# Altium schematic sheet UART.SchDoc
size A4; SheetNumber: 8; SheetTotal: 8
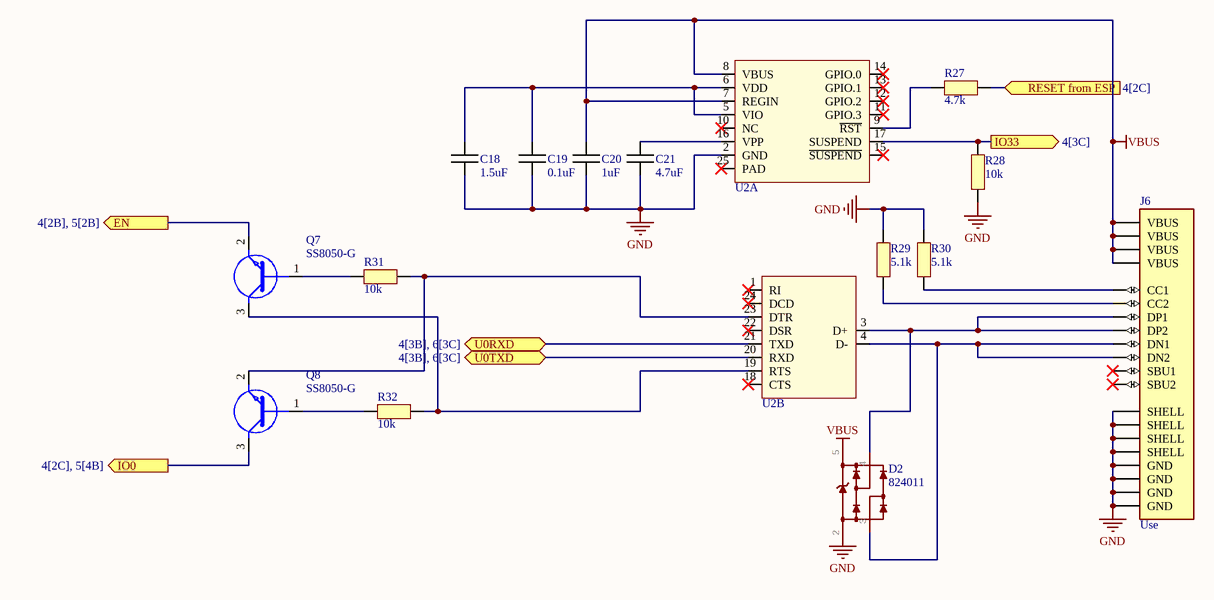
[diagram p0: UART.SchDoc]

## Parts
C18  1.5uF  [CAPC1005X06N]
C19  0.1uF  [CAPC1005X06N]
C20  1uF  [CAPC1005X06N]
C21  4.7uF  [CAPC1005X06N]
D2  824011  [824011]
J6  Use  [USB4085-GF-A]
Q7  SS8050-G  [SS8050-G]
Q8  SS8050-G  [SS8050-G]
R27  4.7k  [RESC1005X06N]
R28  10k  [RESC1005X06N]
R29  5.1k  [RESC1005X06N]
R30  5.1k  [RESC1005X06N]
R31  10k  [RESC1005X06N]
R32  10k  [RESC1005X06N]
U2  CP2104-F03-GM  [PQFN50P400X400X80_HS-25N]  (value not drawn)  (parts A,B of 2)

## Ports
EN (out, see 4[2B], 5[2B]), IO0 (out, see 4[2C], 5[4B]), IO33 (out, see 4[3C]), RESET from ESP (in, see 4[2C]), U0RXD (bidir, see 4[3B], 6[3C]), U0TXD (bidir, see 4[3B], 6[3C])

## Nets
GND: C18.2 C19.2 C20.2 C21.2 D2.2(GND) J6.A1(GND) J6.A12(GND) J6.B1(GND) J6.B12(GND) J6.S1(SHELL) J6.S2(SHELL) J6.S3(SHELL) J6.S4(SHELL) R28.2 R29.2 R30.2 U2.2(GND)
VBUS: C20.1 D2.5(VDD) J6.A4(VBUS) J6.A9(VBUS) J6.B4(VBUS) J6.B9(VBUS) U2.7(REGIN) U2.8(VBUS)
EN: Q7.2(E) ; port EN
IO0: Q8.3(C) ; port IO0
IO33: R28.1 U2.17(SUSPEND) ; port IO33
RESET from ESP: R27.1 ; port RESET from ESP
U0RXD: U2.21(TXD) ; port U0RXD
U0TXD: U2.20(RXD) ; port U0TXD
NetC18_1: C18.1 C19.1 U2.5(VIO) U2.6(VDD)
NetC21_1: C21.1 U2.16(VPP)
NetD2_3: D2.3 J6.A7(DN1) J6.B7(DN2) U2.4(D-)
NetD2_4: D2.4 J6.A6(DP1) J6.B6(DP2) U2.3(D+)
NetJ6_A5: J6.A5(CC1) R30.1
NetJ6_B5: J6.B5(CC2) R29.1
NetQ7_1: Q7.1(B) R31.2
NetQ7_3: Q7.3(C) R32.1 U2.19(RTS)
NetQ8_1: Q8.1(B) R32.2
NetQ8_2: Q8.2(E) R31.1 U2.23(DTR)
NetR27_2: R27.2 U2.9(~{RST})

Not connected (* = marked no-connect by the designer): J6 A8(SBU1)* B8(SBU2)*; U2 1(RI)* 10(NC)* 11(GPIO.3)* 12(GPIO.2)* 13(GPIO.1)* 14(GPIO.0)* 15(~{SUSPEND})* 18(CTS)* 22(DSR)* 24(DCD)* 25(PAD)*

## Library data of the parts
C18-C21 = Capacitor
D2 = 824011: TVS Diode Array WE-TVS, High Speed Series  - Low capazity - No leakage current - Low clamping voltage - high ESD voltage protection  -- USB 1.0 - 2.0
J6 = USB4085-GF-A: Connecteurs USB USB Type C, 2.0, Rec, TH , G/F, RA , Top Mnt, T & R
Q7 Q8 = SS8050-G: Bipolar Transistors - BJT NPN TRANSISTOR 1.5A 40V
R27-R32 = Resistor
U2 = USBBridge: USB Bridge, USB to UART USB 2.0 UART Interface 24-QFN (4x4); Manufacturer 1: Silicon Labs; Supplier 1: Arrow Electronics; Supplier Part Number 1: CP2104-F03-GM; Manufacturer Part Number 1: CP2104-F03-GM